# EAGLE schematic ESP_8266 (EAGLE 9.6.2)
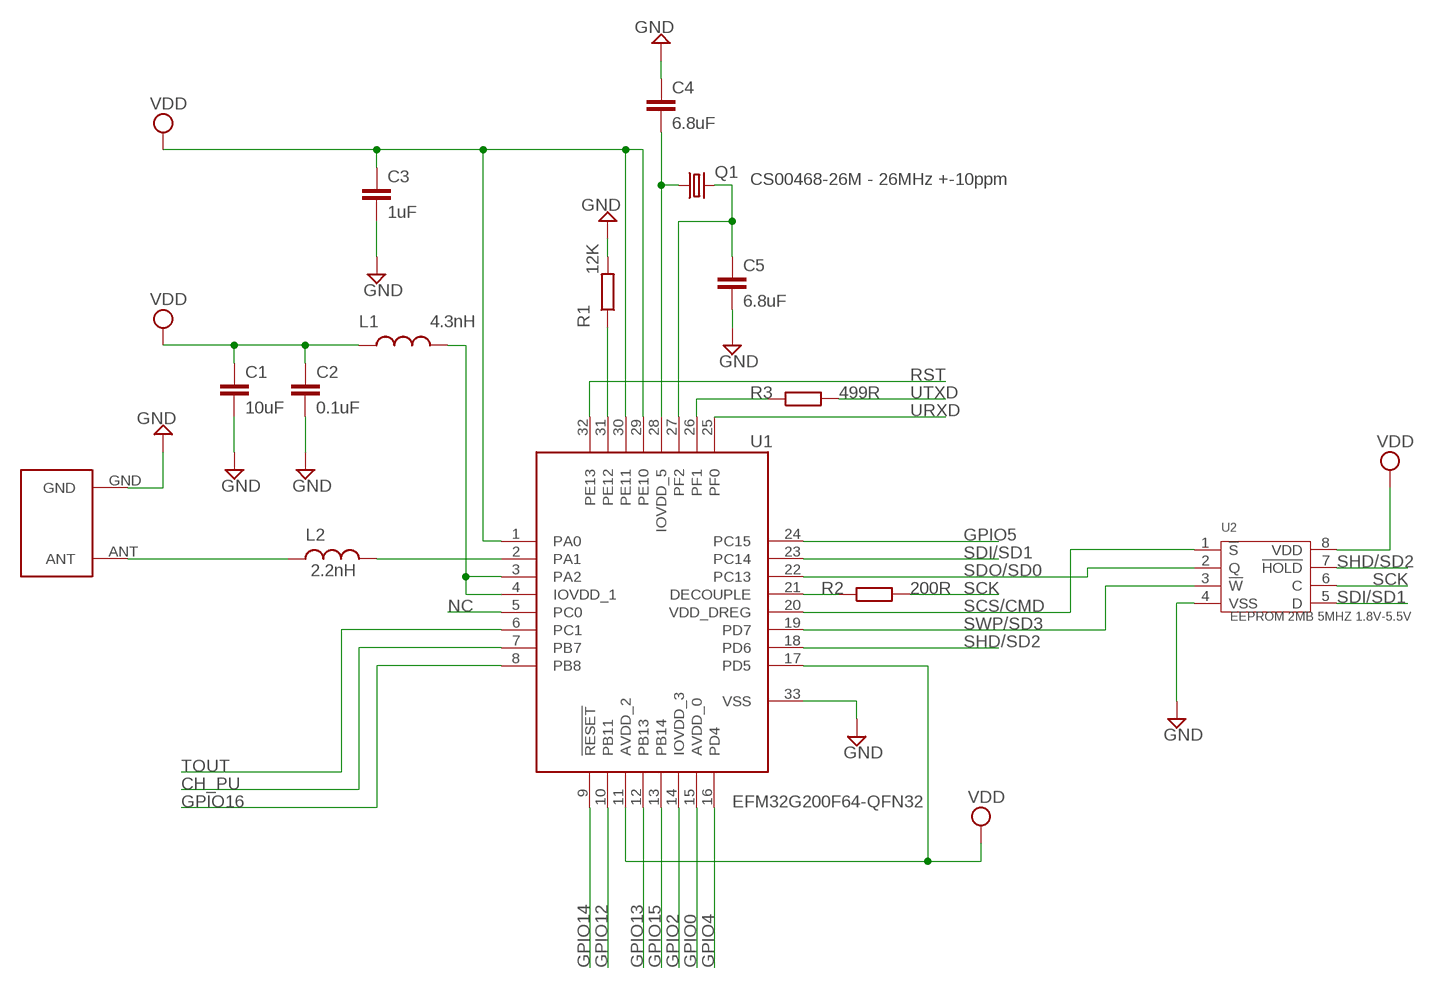
[diagram p0: schematic, sheet 1]

## Parts
C1  10uF  C-EUC0402  [C0402]
C2  0.1uF  C-EUC0402  [C0402]
C3  1uF  C-EUC0402  [C0402]
C4  6.8uF  C-EUC0402  [C0402]
C5  6.8uF  C-EUC0402  [C0402]
L1  4.3nH  L  (no package)
L2  2.2nH  L  (no package)
Q1  CS00468-26M - 26MHz +-10ppm  CRYSTALCTS406  [CTS406]
R1  12K  R  (no package)
R2  200R  R  (no package)
R3  499R  R  (no package)
U1  EFM32G200F64-QFN32  [QFN65P600X600X90-33N]
U2  EEPROM 2MB 5MHZ 1.8V-5.5V  MCU-M95M02-DRMN6TP(SOIC8)  [SOIC8-1.27-5X4MM]
U$1  ESP8266_ANTENNA  [ESP8266_ANTENNA]

## Nets
CH_PU: U1.7(PB7)
GND: C1.2 C2.2 C3.2 C4.1 C5.2 R1.2 U1.33(VSS) U2.4(VSS) U$1.GND
GPIO0: U1.15(AVDD_0)
GPIO2: U1.14(IOVDD_3)
GPIO4: U1.16(PD4)
GPIO5: U1.24(PC15)
GPIO12: U1.10(PB11)
GPIO13: U1.12(PB13)
GPIO14: U1.9(!RESET)
GPIO15: U1.13(PB14)
GPIO16: U1.8(PB8)
N$1: L2.1 U$1.ANT
N$2: R3.1 U1.26(PF1)
N$3: R2.1 U1.21(DECOUPLE)
N$4: R1.1 U1.31(PE12)
N$5: L2.2 U1.2(PA1)
N$6: L1.2 U1.3(PA2) U1.4(IOVDD_1)
N$7: U2.7(!HOLD)
N$8: U2.6(C)
N$9: C4.2 Q1.1 U1.28(IOVDD_5)
N$10: C5.1 Q1.3 U1.27(PF2)
N$11: U2.5(D)
NC: U1.5(PC0)
RST: U1.32(PE13)
SCK: R2.2
SCS/CMD: U1.20(VDD_DREG) U2.1(!S)
SDI/SD1: U1.23(PC14)
SDO/SD0: U1.22(PC13) U2.2(Q)
SHD/SD2: U1.18(PD6)
SWP/SD3: U1.19(PD7) U2.3(!W)
TOUT: U1.6(PC1)
URXD: U1.25(PF0)
UTXD: R3.2
VDD: C1.1 C2.1 C3.1 L1.1 U1.1(PA0) U1.11(AVDD_2) U1.17(PD5) U1.29(PE10) U1.30(PE11) U2.8(VDD)

## Library data of the parts
C1-C5 = rcl:C-EU: CAPACITOR, European symbol; SPICEPREFIX: C
L1 L2 = ngspice-simulation:L: INDUCTOR
Q1 = crystal:CRYSTAL: CRYSTAL; OC_FARNELL: unknown; OC_NEWARK: unknown
R1-R3 = ngspice-simulation:R: RESISTOR
U1 = EFM32G200F64-QFN32:EFM32G200F64-QFN32: The EFM32G offers unmatched performance and ultra low power consumption in both active and sleep modes. EFM32G devices consume as little as 0.6 μA in Stop mode and 180 μA/MHz in Run mode. It also features autonomous peripherals, high overall chip and analog integration, and the performance of the industry standard 32-bit ARM Cortex-M3 processor, making it perfect for battery-powered systems and systems with high-performance, low-energy requirements. Check availability <https://pricing.snapeda.com/parts/EFM32G200F64-QFN32/Silicon%20Labs/view-part?ref=eda>; AVAILABILITY: In Stock; CHECK_PRICES: https://www.snapeda.com/parts/EFM32G200F64-QFN32/Silicon+Labs/view-part/?ref=eda; DESCRIPTION: ARM® Cortex®-M3 series Microcontroller IC 32-Bit Single-Core 32MHz 64KB (64K x 8) FLASH 32-QFN (6x6); MF: Silicon Labs; MP: EFM32G200F64-QFN32; PACKAGE: QFN-32 Silicon Labs; PRICE: None; SNAPEDA_LINK: https://www.snapeda.com/parts/EFM32G200F64-QFN32/Silicon+Labs/view-part/?ref=snap
U2 = MCU-M95M02-DRMN6TP_SOIC8_:MCU-M95M02-DRMN6TP(SOIC8): 310090069; MPN: M95M02-DRMN6TP
U$1 = ESP8266_Antenna:ESP8266_ANTENNA: PCB trace antenna for the ESP8266